# Altium schematic sheet Analog.SchDoc
size A4
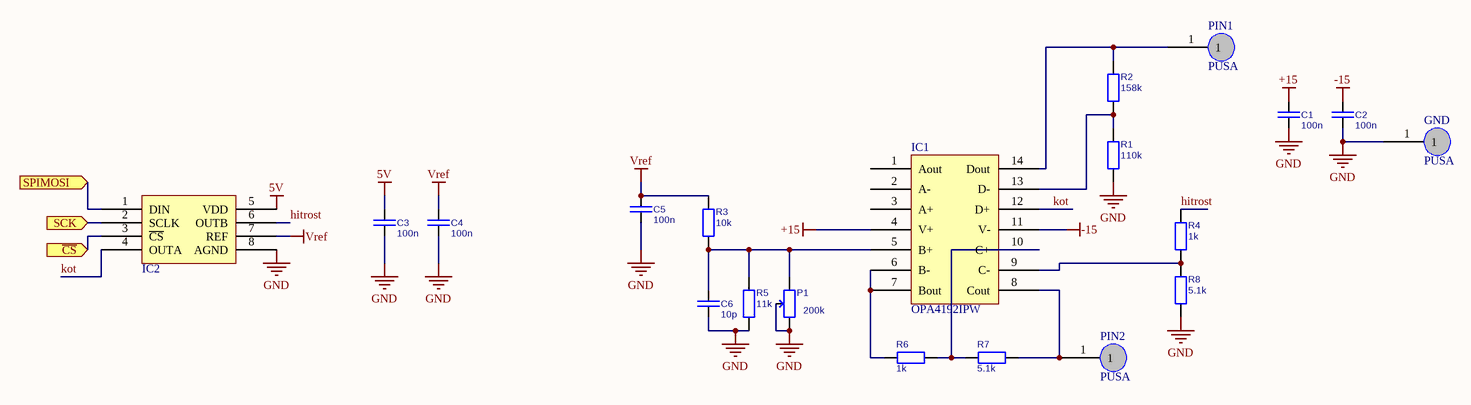
[diagram p0: Analog.SchDoc]

## Parts
C1  100n  [C0603]
C2  100n  [C0603]
C3  100n  [C0603]
C4  100n  [C0603]
C5  100n  [C0603]
C6  10p  [C0603]
GND  PUSA  [PUSA]
IC1  OPA4192IPW  [OPA4192]
IC2  TLV5618ACD  [TLV5618ACD]  (value not drawn)
P1  200k  [Bourns_3266W]
PIN1  PUSA  [PUSA]
PIN2  PUSA  [PUSA]
R1  110k  [R0603]
R2  158k  [R0603]
R3  10k  [R0603]
R4  1k  [R0603]
R5  11k  [R0603]
R6  1k  [R0603]
R7  5.1k  [R0603]
R8  5.1k  [R0603]

## Ports
SCK (in), SPIMOSI (in), ~{CS} (in)

## Nets
5V: C3.1 IC2.5(VDD)
+15: C1.1 IC1.4(V+)
-15: C2.1 IC1.11(V-)
GND: C1.2 C2.2 C3.2 C4.2 C5.2 C6.2 GND.1 IC2.8(AGND) P1.2 P1.3 R1.2 R5.2 R8.2
Vref: C4.1 C5.1 IC2.7(REF) R3.1
~{CS}: IC2.3(~{CS}) ; port ~{CS}
hitrost: IC2.6(OUTB) R4.2
kot: IC1.12(D+) IC2.4(OUTA)
SCK: IC2.2(SCLK) ; port SCK
SPIMOSI: IC2.1(DIN) ; port SPIMOSI
NetC6_1: C6.1 IC1.5(B+) P1.1 R3.2 R5.1
NetIC1_6: IC1.6(B-) IC1.7(Bout) R6.2
NetIC1_8: IC1.8(Cout) PIN2.1 R7.1
NetIC1_9: IC1.9(C-) R4.1 R8.1
NetIC1_10: IC1.10(C+) R6.1 R7.2
NetIC1_13: IC1.13(D-) R1.1 R2.2
NetIC1_14: IC1.14(Dout) PIN1.1 R2.1

Not connected (* = marked no-connect by the designer): IC1 1(Aout) 2(A-) 3(A+)

## Notes on the sheet
- Title
- Size:
- Date:
- A4
- Number:
- Time:
- Revision:
- Sheet
- of
- File:

## Library data of the parts
C1-C6 = C: Capacitor
  C1-C5: Value: 100n
  C6: Value: 10p
IC1 = OPA4192IPW onepack: Supplier 1: Farnell; Supplier Part Number 1: 2526481
P1 = POT: POTENTIOMETER; Value: 200k; Supplier Part Number 1: 9352651; Supplier 1: Farnell
R1-R8 = R
  R1: Value: 110k
  R2: Value: 158k
  R3: Value: 10k
  R4 R6: Value: 1k
  R5: Value: 11k
  R7 R8: Value: 5.1k
IC2 = TLV5618ACD: Supplier 1: Farnell; Supplier Part Number 1: 2342319